# Altium project stm32-plc.PrjPcb (part 2 of 2)

## Sheet AOut_Isolator.SchDoc
size A4; SheetNumber: 3; SheetTotal: 16
Used 2 times, as channels U_AOUT1, U_AOUT2. Parts and nets are listed once, with the designators drawn on the sheet.
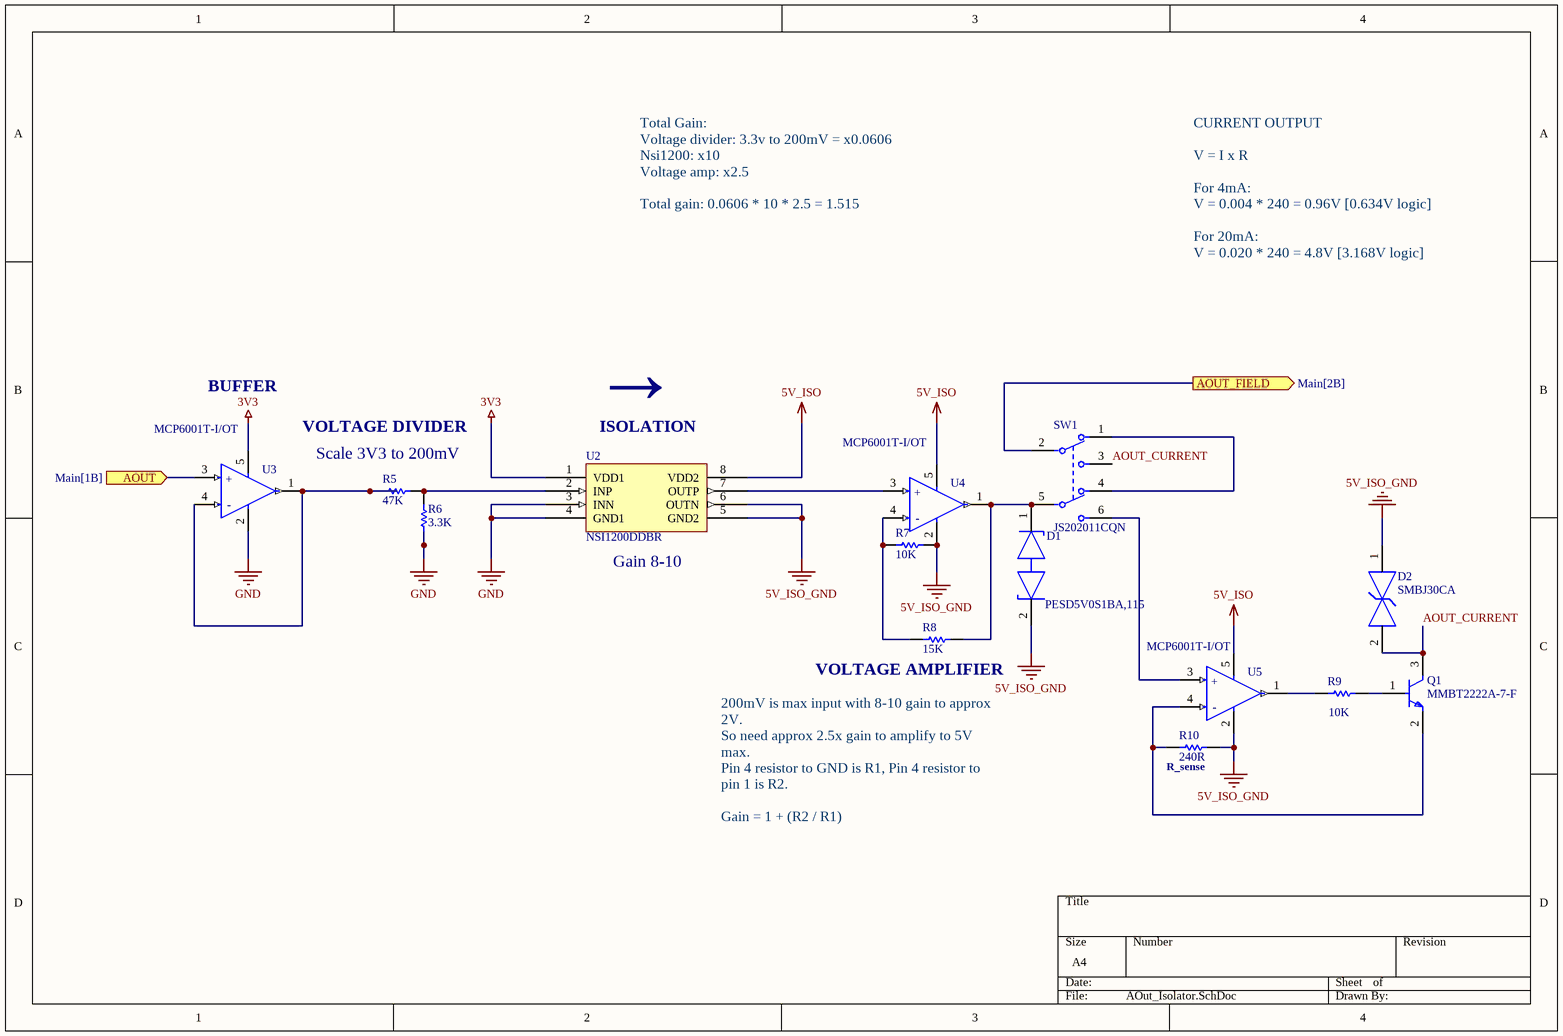
[diagram p9: AOut_Isolator.SchDoc]

### Parts
D1  PESD5V0S1BA,115  [FP-SOD323-CA-MFG]
D2  SMBJ30CA  [FP-SMBJ30CAHE3-52-MFG]
Q1  MMBT2222A-7-F  [FP-SOT23-IPC_A]
R5  47K  [RESC1608X55X30NL15T15]
R6  3.3K  [RESC1609X55X30ML15T15]
R7  10K  [RESC1609X55X30LL15T15]
R8  15K  [RESC1608X55X30NL15T15]
R9  10K  [RESC1609X55X30LL15T15]
R10  240R  [RESC3216X70X50NL05T20]
SW1  JS202011CQN  [FP-JS202011CQN-MFG]
U2  NSI1200DDBR  [NSI1200DDBR]
U3  MCP6001T-I/OT  [FP-C04-091-OT-IPC_A]
U4  MCP6001T-I/OT  [FP-C04-091-OT-IPC_A]
U5  MCP6001T-I/OT  [FP-C04-091-OT-IPC_A]

### Ports
AOUT (in, see Main[1B]), AOUT_FIELD (out, see Main[2B])

### Nets
3V3: U2.1(VDD1) U3.5(VDD)
5V_ISO: U2.8(VDD2) U4.5(VDD) U5.5(VDD)
5V_ISO_GND: D1.2(K2) D2.1 R7.2 R10.1 U2.5(GND2) U2.6(OUTN) U4.2(VSS) U5.2(VSS)
GND: R6.2 U2.3(INN) U2.4(GND1) U3.2(VSS)
AOUT: U3.3(VIN+) ; port AOUT
AOUT_CURRENT: D2.2 Q1.3(C) SW1.3
AOUT_FIELD: SW1.2 ; port AOUT_FIELD
NetD1_1: D1.1(K1) R8.2 SW1.5 U4.1(VOUT)
NetQ1_1: Q1.1(B) R9.2
NetQ1_2: Q1.2(E) R10.2 U5.4(VIN-)
NetR5_1: R5.1 U3.1(VOUT) U3.4(VIN-)
NetR5_2: R5.2 R6.1 U2.2(INP)
NetR7_1: R7.1 R8.1 U4.4(VIN-)
NetR9_1: R9.1 U5.1(VOUT)
NetSW1_1: SW1.1 SW1.4
NetSW1_6: SW1.6 U5.3(VIN+)
NetU2_7: U2.7(OUTP) U4.3(VIN+)

### Channels
U_AOUT1: designators end in A; ports AOUT=AOUT1 AOUT_FIELD=AOUT1_FIELD
U_AOUT2: designators end in B; ports AOUT=AOUT2 AOUT_FIELD=AOUT2_FIELD

### Notes on the sheet
- Total Gain:
  Voltage divider: 3.3v to 200mV = x0.0606
  Nsi1200: x10
  Voltage amp: x2.5
  Total gain: 0.0606 * 10 * 2.5 = 1.515
- CURRENT OUTPUT
  V = I x R
  For 4mA:
  V = 0.004 * 240 = 0.96V [0.634V logic]
  For 20mA:
  V = 0.020 * 240 = 4.8V [3.168V logic]
- (near U2) ←
- BUFFER
- VOLTAGE DIVIDER
- (near U2) ISOLATION
- Scale 3V3 to 200mV
- (near U2) Gain 8-10
- (near R8) VOLTAGE AMPLIFIER
- (near R10) R_sense
- 200mV is max input with 8-10 gain to approx 2V.
  So need approx 2.5x gain to amplify to 5V max.
  Pin 4 resistor to GND is R1, Pin 4 resistor to pin 1 is R2.
  Gain = 1 + (R2 / R1)
- (in symbol CMP-0187-00462-3) +; -

### Library data of the parts
D1 = CMP-14432-000001-1: TVS DIODE 5V 14V SOD323
D2 = CMP-02577-000018-1: TVS DIODE 30V 48.4V DO214AA; Manufacturer: Vishay Semiconductor Diodes Division; Manufacturer Part Number: SMBJ30CAHE3/52; Peak Pulse Power: 600W; Number Of Channels: 1; Automotive Grade: Grade 0; Peak Pulse Current: 12.4A; Standoff Height: 0mm; Max Junction Temp: +150°C; Breakdown Voltage: 33.3V; Direction: Bidirectional; Octopart: https://octopart.com/smbj30cahe3%2F52-vishay-43725255; Footprint Url: http://www.vishay.com/docs/95401/smb.pdf; Device Class L2: TVS Diodes; RoHS: TRUE; Automotive: Yes; Height: 2.44mm; Temperature: -55°C to +150°C; Category: Diode; ComponentLink2Description: Datasheet; Reverse Standoff Voltage: 30V; Device Class L3: unset; Package: DO-214AA; ComponentLink2URL: http://www.vishay.com/docs/88392/smbj.pdf; Temperature Range Low: -55°C; Mouser Description: Diode TVS Single Bi-Dir 30V 600W 2-Pin DO-214AA T/R; Temperature Range High: +150°C; Digikey Description: TVS DIODE 30V 48.4V DO214AA; Clamping Voltage: 48.4V; Lead Free: Yes; Device Class L1: Circuit Protection
Q1 = CMP-1693-00003-4: TRANS NPN 40V 0.6A SMD SOT23-3; Number of Elements: 1; Frequency: 300MHz; Max Collector Current: 600mA; Collector Base Voltage (VCBO): 75V; Current: 1A; Element Configuration: Single; Power Dissipation: 350mW; hFE Min: 100; Collector Emitter Saturation Voltage: 1V; Max Power Dissipation: 300mW; Emitter Base Voltage (VEBO): 6V; Voltage: 40V; Collector Emitter Breakdown Voltage: 40V; Width: 1.4mm; Polarity: NPN; Termination: SMD/SMT; Max Operating Temperature: 150°C; Transition Frequency: 300MHz; Contact Plating: Tin; Mount: Surface Mount; Max Frequency: 300MHz; Case/Package: SOT-23; Gain Bandwidth Product: 300MHz; Lead Free: Lead Free; Collector Emitter Voltage (VCEO): 40V; Radiation Hardening: No; Voltage Rating (DC): 40V; Height: 1mm; Max Breakdown Voltage: 40V; Packaging: Tape and Reel; Length: 3.05mm; Min Operating Temperature: -55°C; Weight: 0.000282oz; Current Rating: 600mA; REACH SVHC: No SVHC; Package Quantity: 3000; Continuous Collector Current: 600mA; Number of Pins: 3
R5 = CMP-2000-00523-2: Chip Resistor, 47 KOhm, +/- 1%, 0.1 W, -55 to 155 degC, 0603 (1608 Metric), RoHS, Tape and Reel; Case\Package: 0603; Forward Current: 20 mA; Power Rating: 90 mW; Illumination Colour: Red; Nominal Vf: 2.1 V; Viewing Angle: 160 degrees; Luminous Intensity: 63 mcd; Lens Style: Clear; Nominal Wavelength: 639 nm; Case Code (Imperial): 0603; Case Code (Metric): 1608; Packaging: Tape and Reel; Radiation Hardening: No; Colour: Red; PackageDescription: 2-Pin Surface Mount Device, Body 1.6 x 0.85 mm; ComponentLink1Description: Manufacturer URL; Width: 0.8 mm; DatasheetVersion: Apr-15; ComponentLink2URL: http://industrial.panasonic.com/cdbs/www-data/pdf/RDA0000/AOA0000C86.pdf; Min Operating Temperature: -40 degC; Height: 0.6 mm; Package Quantity: 3000; ComponentLink2Description: Datasheet; REACH SVHC: No SVHC; ComponentLink1URL: http://www.panasonic.com/; Mount: Surface Mount; RoHSCompliant: true; Max Operating Temperature: 100 degC; PackageReference: 0603; Length: 1.6 mm; Forward Voltage: 2.1 V; Pins: 2
R6 = CMP-2000-00436-2: Chip Resistors, 3.3 KOhm, +/- 1%, 0.1 W, 0603 (1608 Metric), -55 to 155 degC, RoHS, Tape and Reel; Manufacturer: Panasonic; Max Power Dissipation: 100mW; Voltage Rating: 75V; Temperature Coefficient: 100ppm/degreesC; Datasheet Version: 42095.0; Width: 0.8mm; Mount: SurfaceMount; Radiation Hardening: No; Package URL: http://www.st.com/st-web-ui/static/active/en/resource/technical/document/datasheet/CD00001320.pdf; Depth: 0.8mm; Package Description: 2-Pin Surface Mount Device, Body 1.6 x 0.85 mm; Package Quantity: 1; Contact Plating: Tin; Length: 1.6mm; Max Operating Temperature: 155degC; RoHSCompliant: true; Datasheet URL: https://industrial.panasonic.com/cdbs/www-data/pdf/RDA0000/AOA0000C283.pdf; Height: 0.022inch; Military Standard: Not; Termination: SMD/SMT; Case Code (Metric): 1608; Composition: ThickFilm; Resistance: 3.3KOhm; Packaging: TapeandReel; Min Operating Temperature: -55degC; Case/Package: 0603; Voltage Rating (DC): 75V; Lead Free: LeadFree; Package Reference: 0603; Power Rating: 100mW; Manufacturer URL: http://www.panasonic.com/; Case Code (Imperial): 0603; REACH SVHC: NoSVHC; Number of Terminations: 2; Number of Pins: 2; Tolerance: 1%
R7 R9 = CMP-1012-00623-3: Chip Resistor, 10 KOhm, +/- 1%, 0.1 W, -55 to 155 degC, 0603 (1608 Metric), RoHS, Tape and Reel; Manufacturer: Panasonic; Voltage Rating: 75V; Case\/Package: 0603; Power Rating: 100mW; Resistance: 10KOhm; Temperature Coefficient: 100ppm\/degreesC; Number of Pins: 2; Package Reference: 603; Depth: 0.8mm; Mount: SurfaceMount; Package Description: 2-Pin Surface Mount Device, Body 1.6 x 0.85 mm; Datasheet Version: 02/2017; Length: 1.6mm; Lead Free: LeadFree; Height: 0.45mm; Number of Terminations: 2; Max Power Dissipation: 100mW; Min Operating Temperature: -55degC; Datasheet URL: https://industrial.panasonic.com/cdbs/www-data/pdf/RDA0000/AOA0000C304.pdf; Termination: SMD/SMT; Case Code (Metric): 1608; Case Code (Imperial): 0603; Tolerance: 1%; Max Operating Temperature: 155degC; RoHSCompliant: true; Voltage Rating (DC): 75V; Radiation Hardening: No; Packaging: TapeandReel; Composition: ThickFilm; Mounting Technology: SurfaceMount; Manufacturer URL: http://www.panasonic.com/; Width: 0.031inch; REACH SVHC: NoSVHC; Contact Plating: Tin; Military Standard: Not; Package Quantity: 1
R8 = CMP-2000-00258-1: Part Number: ERJ-3EKF1502V; Manufacturer: Panasonic
R10 = CMP-2003-00592-1: Part Number: ERJ-8GEYJ241V; Manufacturer: Panasonic
SW1 = CMP-10038-000022-1: SWITCH SLIDE DPDT 300MA 6V; Contact Resistance: 70mR; Actuator Type: Standard; Actuator Color: Black; Actuator Material: Nylon; Actuator Length: 2mm; Contact Current Rating: 100mA; Electrical Life: 5000Cycles; Illumination Type: Non-Illuminated; Switch Function: On-On; Depth: 3.6mm; Lead Free: Lead Free; Current Rating: 300mA; Throw Configuration: DPDT; REACH SVHC: No SVHC; Flammability Rating: UL94 V-0; Contact Plating: Silver; Max Current Rating: 300mA; Packaging: Bulk; Radiation Hardening: No; Switch Travel: 2mm; Package Quantity: 1; Voltage Rating (DC): 6V; Housing Material: Nylon; Contact Material: Copper Alloy; Min Operating Temperature: -40°C; Max Operating Temperature: 85°C; Termination: PC Pins; Mount: Through Hole; Length: 9mm; Max Voltage Rating (DC): 6V; RoHS Compliant: Yes; Series: JS; Orientation: Vertical
U2 = NSI1200DDBR: High Reliability Reinforced Isolated Amplifier; Manufacturer: Novosense; Manufacturer Part Number: NSI1200DDBR; ComponentLink1Description: Datasheet; ComponentLink1URL: https://file.elecfans.com/web2/M00/63/D8/poYBAGMEo2GAVfdLABzacvfTaPY750.pdf
U3-U5 = CMP-0187-00462-3: IC OPAMP GP 1 CIRCUIT SOT23-5; Number of Amplifiers: 1; Voltage: 6V; Power Supply Rejection Ratio (PSRR): 86dB; Common Mode Rejection Ratio: 60dB; Unity Gain Bandwidth Product: 1MHz; Slew Rate: 0.6V/µs; Output Current per Channel: 23mA; Nominal Supply Current: 100uA; Input Offset Voltage (Vos): 4.5mV; Input Bias Current: 1pA; Operating Supply Voltage: 5.5V; Min Supply Voltage: 1.8V; Voltage Gain: 112dB; Length: 3.1mm; REACH SVHC: No SVHC; Number of Pins: 5; Package Quantity: 1; Radiation Hardening: No; Mount: Surface Mount; Number of Circuits: 1; Number of Elements: 1; Output Current: 23mA; Packaging: Tape and Reel; Height: 1.3mm; Lead Free: Lead Free; Min Operating Temperature: -40°C; Bandwidth: 1MHz; Contact Plating: Tin; Max Supply Voltage: 6V; Max Operating Temperature: 85°C; Width: 1.8mm; Case/Package: SOT-23; Operating Supply Current: 100uA; Number of Channels: 1; Gain Bandwidth Product: 1MHz

## Sheet BTN2_FactoryReset.SchDoc
size A4; SheetNumber: 13; SheetTotal: 16
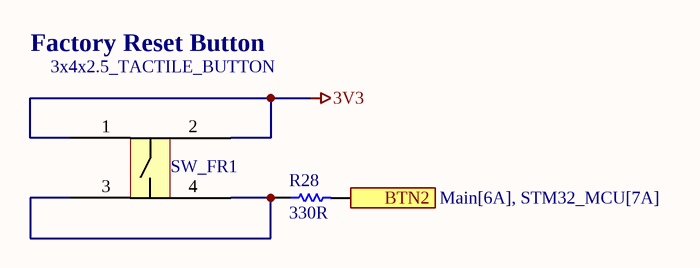
[diagram p10: BTN2_FactoryReset.SchDoc]

### Parts
R28  330R  [RESC1608X55X30LL15T15]
SW_FR1  3x4x2.5_TACTILE_BUTTON  [3x4x2.5_TACTILE_BUTTON]

### Ports
BTN2 (out, see Main[6A], STM32_MCU[7A])

### Nets
3V3: SW_FR1.1 SW_FR1.2
BTN2: R28.2 ; port BTN2
NetR28_1: R28.1 SW_FR1.3 SW_FR1.4

### Notes on the sheet
- Factory Reset Button

### Library data of the parts
R28 = CMP-2000-00435-2: Chip Resistor, 330 Ohm, +/- 1%, 0.1 W, -55 to 155 degC, 0603 (1608 Metric), RoHS, Tape and Reel; Gender: Male; Mating Cycles: 10000; Current Rating: 500 mA; Voltage Rating: 10 V; REACH SVHC: No SVHC; PackageDescription: 2-Pin Surface Mount Device, Body 1.6 x 0.85 mm; Contact Finish: Gold; Pins: 8; ComponentLink1Description: Manufacturer URL; Packaging: Tape and Reel; Max Operating Temperature: 85 degC; Contact Material: Copper; Height: 1.45 mm; Width: 1.45 mm; DatasheetVersion: Apr-15; Package Quantity: 1500; Contact Plating: Gold; PackageReference: 0603; Mount: Surface Mount; Lead Pitch: 1.1 mm; Min Operating Temperature: -25 degC; ComponentLink1URL: http://www.panasonic.com/; ComponentLink2URL: http://industrial.panasonic.com/cdbs/www-data/pdf/RDA0000/AOA0000C86.pdf; Length: 13.7 mm; ComponentLink2Description: Datasheet; RoHSCompliant: true

## Sheet STM32_MCU.SchDoc
size A3; SheetNumber: 7; SheetTotal: 16
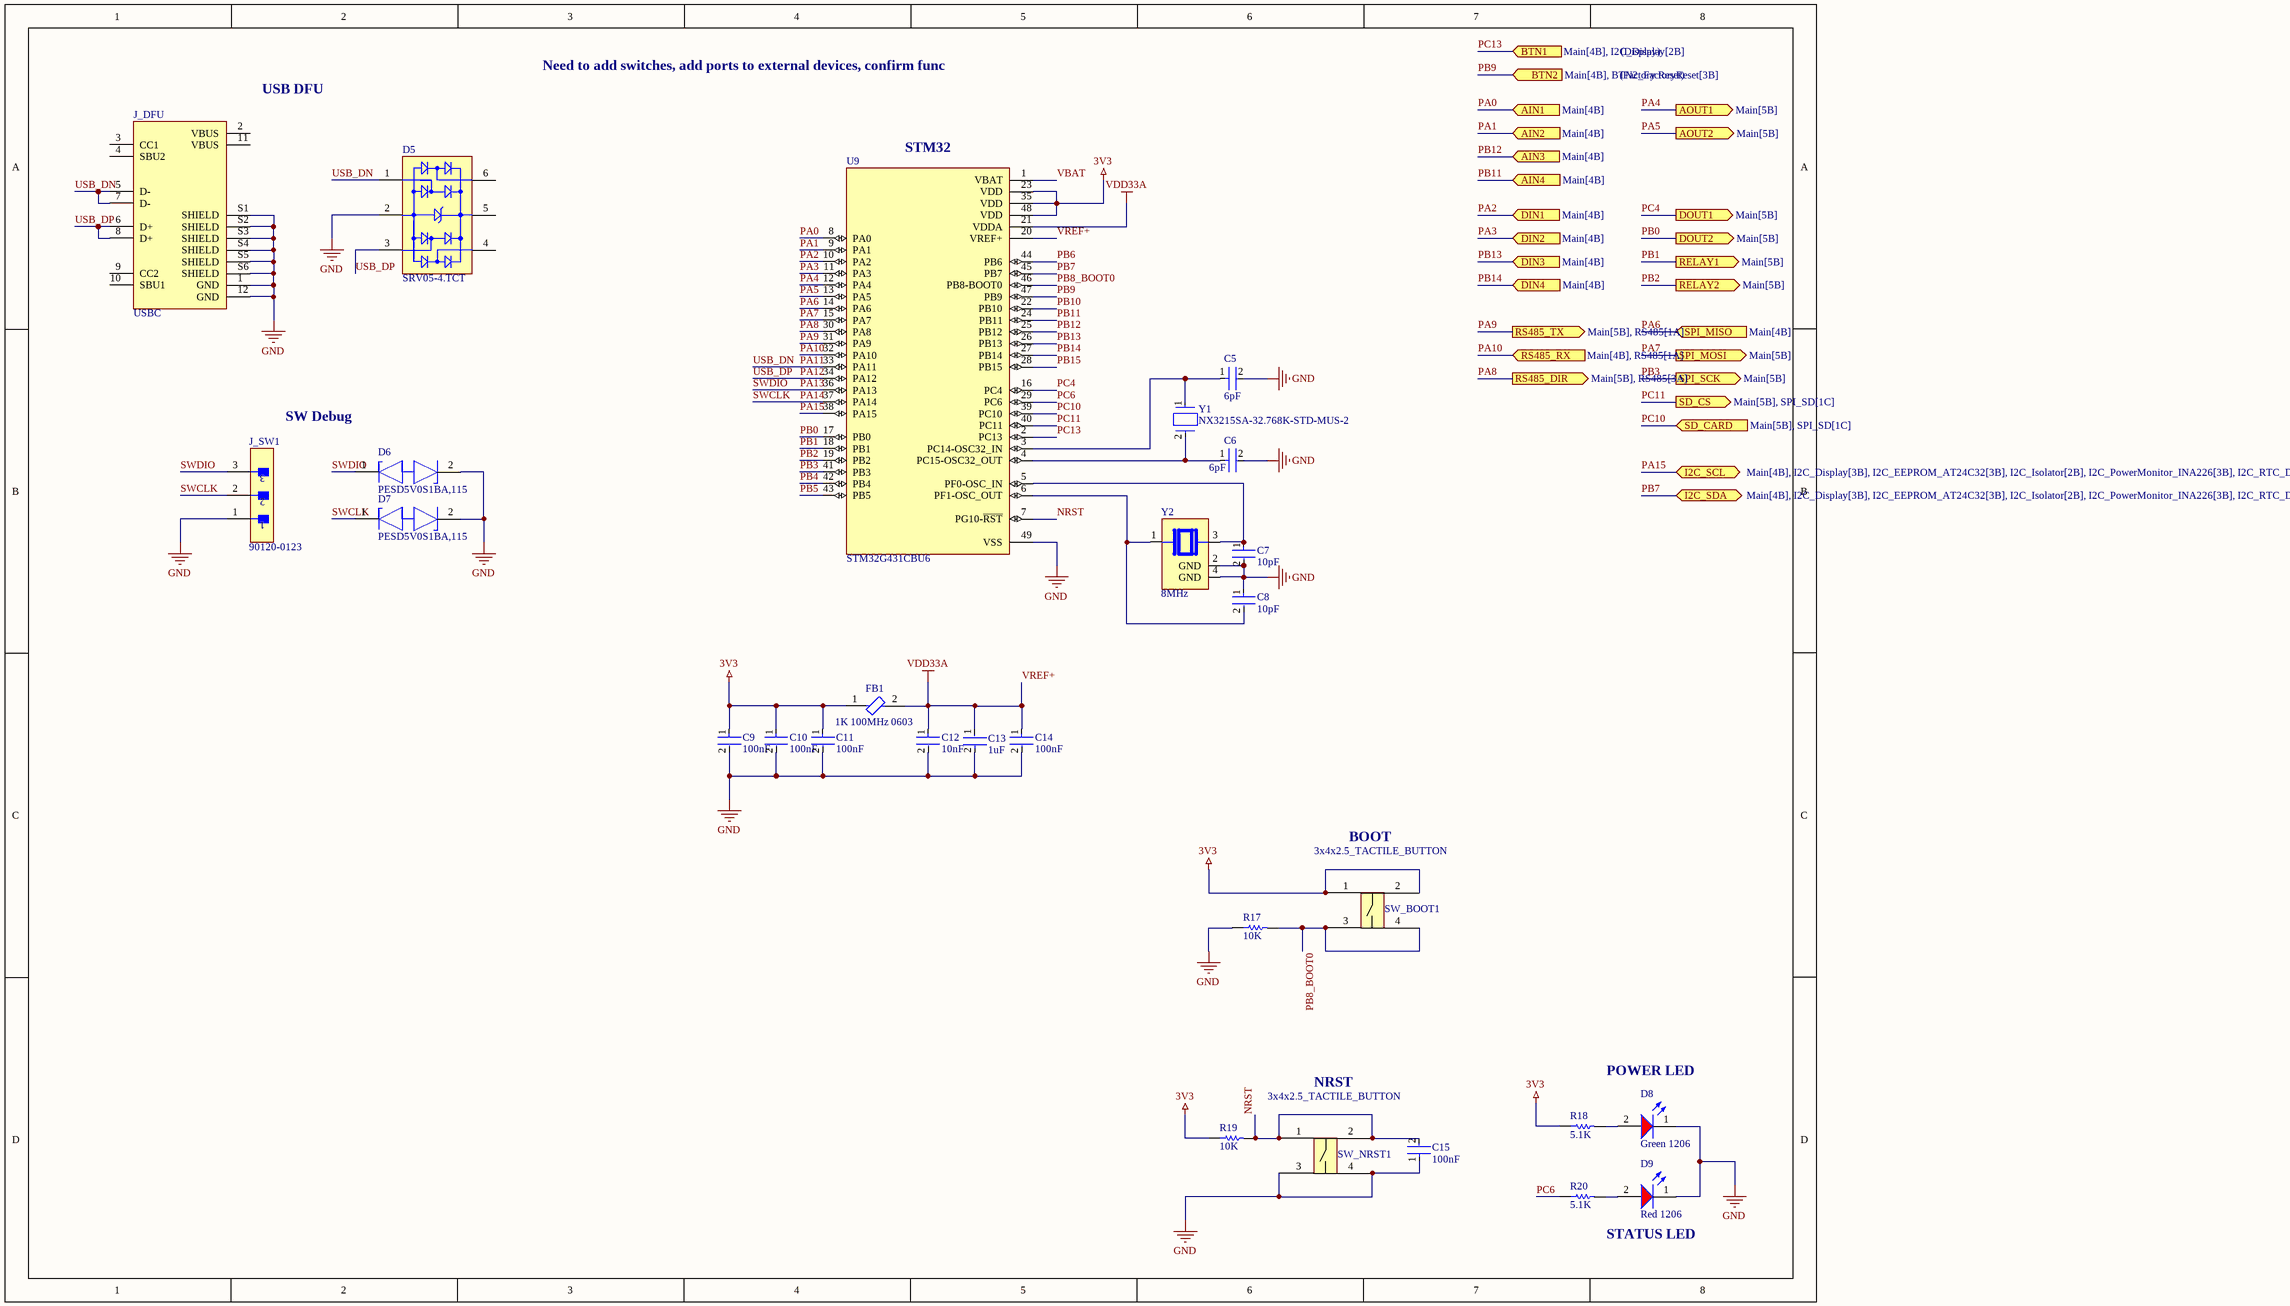
[diagram p11: STM32_MCU.SchDoc]

### Parts
C5  6pF  [FP-CGA3E-0_3-0_1-MFG]
C6  6pF  [FP-CGA3E-0_3-0_1-MFG]
C7  10pF  [FP-C0603C-CF-MFG]
C8  10pF  [FP-C0603C-CF-MFG]
C9  100nF  [FP-CGA3E-0_3-0_1-IPC_A]
C10  100nF  [FP-CGA3E-0_3-0_1-IPC_A]
C11  100nF  [FP-CGA3E-0_3-0_1-IPC_A]
C12  10nF  [FP-CC0603-DA-MFG]
C13  1uF  [FP-C1608-080-0_1-IPC_B]
C14  100nF  [FP-CGA3E-0_3-0_1-IPC_A]
C15  100nF  [FP-CGA3E-0_3-0_1-IPC_A]
D5  SRV05-4.TCT  [SMTC-SOT23-6_V]
D6  PESD5V0S1BA,115  [FP-SOD323-CA-MFG]
D7  PESD5V0S1BA,115  [FP-SOD323-CA-MFG]
D8  Green 1206  [WL-SMCW_1206_150120xx75000]
D9  Red 1206  [WL-SMCW_1206_150120xx75000]
FB1  1K 100MHz 0603  [FP-BLM18-0_15-t0_8-MFG]
J_DFU  USBC  [JAE_DX07S016JA1R1500]
J_SW1  90120-0123  [FP-90120-0123-MFG]
R17  10K  [RESC1609X55X30LL15T15]
R18  5.1K  [RESC1608X55X30LL15T15]
R19  10K  [RESC1609X55X30LL15T15]
R20  5.1K  [RESC1608X55X30LL15T15]
SW_BOOT1  3x4x2.5_TACTILE_BUTTON  [3x4x2.5_TACTILE_BUTTON]
SW_NRST1  3x4x2.5_TACTILE_BUTTON  [3x4x2.5_TACTILE_BUTTON]
U9  STM32G431CBU6  [QFN50P700X700X60-49N]
Y1  NX3215SA-32.768K-STD-MUS-2  [FP-NX3215SA-MFG]
Y2  8MHz  [XTAL_C3E-8.000-10-1020-M]

### Ports
AIN1 (in, see Main[4B]), AIN2 (in, see Main[4B]), AIN3 (in, see Main[4B]), AIN4 (in, see Main[4B]), AOUT1 (out, see Main[5B]), AOUT2 (out, see Main[5B]), BTN1 (in, see Main[4B], I2C_Display[2B]), BTN2 (in, see Main[4B], BTN2_FactoryReset[3B]), DIN1 (in, see Main[4B]), DIN2 (in, see Main[4B]), DIN3 (in, see Main[4B]), DIN4 (in, see Main[4B]), DOUT1 (out, see Main[5B]), DOUT2 (out, see Main[5B]), I2C_SCL (bidir, see Main[4B], I2C_Display[3B], I2C_EEPROM_AT24C32[3B], I2C_Isolator[2B], I2C_PowerMonitor_INA226[3B], I2C_RTC_DS3231[2B]), I2C_SDA (bidir, see Main[4B], I2C_Display[3B], I2C_EEPROM_AT24C32[3B], I2C_Isolator[2B], I2C_PowerMonitor_INA226[3B], I2C_RTC_DS3231[2B]), RELAY1 (out, see Main[5B]), RELAY2 (out, see Main[5B]), RS485_DIR (out, see Main[5B], RS485[3A]), RS485_RX (in, see Main[4B], RS485[1A]), RS485_TX (out, see Main[5B], RS485[1A]), SD_CARD (in, see Main[5B], SPI_SD[1C]), SD_CS (out, see Main[5B], SPI_SD[1C]), SPI_MISO (in, see Main[4B]), SPI_MOSI (out, see Main[5B]), SPI_SCK (out, see Main[5B])

### Nets
3V3: C9.1 C10.1 C11.1 FB1.1 R18.1 R19.1 SW_BOOT1.1 SW_BOOT1.2 U9.23(VDD) U9.35(VDD) U9.48(VDD)
GND: C5.2 C6.2 C7.2 C8.1 C9.2 C10.2 C11.2 C12.2 C13.2 C14.2 C15.1 D5.2(GND) D6.2(K2) D7.2(K2) D8.1(K) D9.1(K) J_DFU.1(GND) J_DFU.12(GND) J_DFU.S1(SHIELD) J_DFU.S2(SHIELD) J_DFU.S3(SHIELD) J_DFU.S4(SHIELD) J_DFU.S5(SHIELD) J_DFU.S6(SHIELD) J_SW1.1 R17.1 SW_NRST1.3 SW_NRST1.4 U9.49(VSS) Y2.2(GND) Y2.4(GND)
VREF+: C12.1 C13.1 C14.1 FB1.2 U9.20(VREF+) U9.21(VDDA)  [also labelled VDD33A]
NRST: C15.2 R19.2 SW_NRST1.1 SW_NRST1.2 U9.7(PG10-~{RST})
PA0: U9.8(PA0) ; port AIN1  [project net AIN1]
PA1: U9.9(PA1) ; port AIN2  [project net AIN2]
PA2: U9.10(PA2) ; port DIN1  [project net DIN1]
PA3: U9.11(PA3) ; port DIN2  [project net DIN2]
PA4: U9.12(PA4) ; port AOUT1  [project net AOUT1]
PA5: U9.13(PA5) ; port AOUT2  [project net AOUT2]
PA6: U9.14(PA6) ; port SPI_MISO  [project net DAT0]
PA7: U9.15(PA7) ; port SPI_MOSI  [project net CMD]
PA8: U9.30(PA8) ; port RS485_DIR
PA9: U9.31(PA9) ; port RS485_TX
PA10: U9.32(PA10) ; port RS485_RX
PA11: D5.1(I/O_1) J_DFU.5(D-) J_DFU.7(D-) U9.33(PA11)  [also labelled USB_DN]
PA12: D5.3(I/O_2) J_DFU.6(D+) J_DFU.8(D+) U9.34(PA12)  [also labelled USB_DP]
PA13: D6.1(K1) J_SW1.3 U9.36(PA13)  [also labelled SWDIO]
PA14: D7.1(K1) J_SW1.2 U9.37(PA14)  [also labelled SWCLK]
PA15: U9.38(PA15) ; port I2C_SCL  [project net I2C_SCL]
PB0: U9.17(PB0) ; port DOUT2  [project net DOUT2]
PB1: U9.18(PB1) ; port RELAY1
PB2: U9.19(PB2) ; port RELAY2
PB3: U9.41(PB3) ; port SPI_SCK
PB4: U9.42(PB4)
PB5: U9.43(PB5)
PB6: U9.44(PB6)
PB7: U9.45(PB7) ; port I2C_SDA  [project net I2C_SDA]
PB8_BOOT0: R17.2 SW_BOOT1.3 SW_BOOT1.4 U9.46(PB8-BOOT0)
PB9: U9.47(PB9) ; port BTN2  [project net BTN2]
PB10: U9.22(PB10)
PB11: U9.24(PB11) ; port AIN4  [project net AIN4]
PB12: U9.25(PB12) ; port AIN3  [project net AIN3]
PB13: U9.26(PB13) ; port DIN3  [project net DIN3]
PB14: U9.27(PB14) ; port DIN4  [project net DIN4]
PB15: U9.28(PB15)
PC4: U9.16(PC4) ; port DOUT1  [project net DOUT1]
PC6: R20.1 U9.29(PC6)
PC10: U9.39(PC10) ; port SD_CARD  [project net CARD_DETECT]
PC11: U9.40(PC11) ; port SD_CS  [project net DAT3]
PC13: U9.2(PC13) ; port BTN1  [project net BTN1]
VBAT: U9.1(VBAT)
NetC5_1: C5.1 U9.3(PC14-OSC32_IN) Y1.1
NetC6_1: C6.1 U9.4(PC15-OSC32_OUT) Y1.2
NetC7_1: C7.1 U9.5(PF0-OSC_IN) Y2.3
NetC8_2: C8.2 U9.6(PF1-OSC_OUT) Y2.1
NetD8_2: D8.2(A) R18.2
NetD9_2: D9.2(A) R20.2

Not connected (* = marked no-connect by the designer): D5 4(I/O_3) 5(VBUS) 6(I/O_4); J_DFU 2(VBUS) 3(CC1) 4(SBU2) 9(CC2) 10(SBU1) 11(VBUS)

### Notes on the sheet
- USB DFU
- Need to add switches, add ports to external devices, confirm func
- (Display)
- (Factory Reset)
- (near U9) STM32
- SW Debug
- BOOT
- NRST
- POWER LED
- STATUS LED

### Library data of the parts
C5 C6 = CMP-08246-001317-1: Cap Ceramic 6pF 50V C0G 0.5pF Pad SMD 0603 +125°C Automotive T/R; Weight: 7.1E-05oz; Capacitance: 6pF; Min Operating Temperature: -55°C; Termination: SMD/SMT; Mount: Surface Mount; Thickness: 0.035inch; Voltage Rating: 50V; Case Code (Metric): 1608; Package Quantity: 1; Length: 1.6mm; Dielectric: C0G; REACH SVHC: No SVHC; Packaging: Tape and Reel; Height: 0.8mm; Composition: Ceramic; Depth: 0.8mm; Case Code (Imperial): 0603; Case/Package: 0603; Max Operating Temperature: 125°C; Voltage Rating (DC): 50V; Ratings: AEC-Q200; Width: 0.031inch
C7 C8 = CMP-2006-03343-2: CAP CER 10PF 50V NP0 0603; Manufacturer: KEMET; Manufacturer Part Number: C0603C100C5GACTU; Material: Ceramic; Temperature Coefficient: 30ppm/°C; Automotive Grade: Grade 1; Tolerance: 0.25 pF; Temperature Characteristic: C0G; Device Class L3: Ceramic Capacitors; Value: 10 pF; Device Class L1: Passive Components; Lead Free: Yes; RoHS: TRUE; Voltage Rating: 50 V; Automotive: Yes; Capacitance: 10 pF; Height: 0.87mm; Temperature Range Low: -55°C; Temperature Range High: +125°C; Mouser Description: Multilayer Ceramic Capacitors MLCC - SMD/SMT 50volts 10pF C0G 0.25%; Device Class L2: Capacitors; Digikey Description: CAP CER 10PF 50V NP0 0603; ComponentLink2Description: Datasheet; Package: C0603C-CF; ComponentLink2URL: https://api.kemet.com/component-edge/download/datasheet/C0603C100J5GACAUTO.pdf; Category: Cap; Octopart: https://octopart.com/c0603c100c5gactu-kemet-9138556; Temperature: -55°C to +125°C
C9-C11 C14 C15 = CMP-2000-07546-2: Cap Ceramic 100nF 50V X7R 10% Pad SMD 0603 +125°C Automotive T/R; Weight: 7.1E-05oz; Composition: Ceramic; Max Operating Temperature: 125°C; Termination: SMD/SMT; Dielectric: X7R; Length: 1.6mm; Package Quantity: 1; REACH SVHC: No SVHC; Lead Free: Lead Free; Case Code (Metric): 1608; Min Operating Temperature: -55°C; Packaging: Tape and Reel; Tolerance: 10%; Voltage Rating: 50V; Case Code (Imperial): 0603; Capacitance: 100nF; Case/Package: 0603; Voltage Rating (DC): 50V; Depth: 0.8mm; Radiation Hardening: No; Ratings: AEC-Q200; Mount: Surface Mount; Voltage: 50V; Thickness: 0.035inch; Width: 0.8mm; Height: 0.8mm
C12 = CMP-2100-03600-2: CAP CER 10000PF 50V X7R 0603; Manufacturer Part Number: CC0603KRX7R9BB103; Manufacturer: YAGEO; Tolerance: 0.1; Material: Ceramic; Temperature Coefficient: 15%; Mouser Description: Multilayer Ceramic Capacitor, CC Series, 0.01 - F, - 10%, X7R, 50 V, 0603 [1608 Metric]; Digikey Description: CAP CER 10000PF 50V X7R 0603; Height: 0.9mm; Category: Cap; Temperature Characteristic: X7R; Footprint Url: http://www.yageo.com/exep/pages/download/literatures/UPY-C_GEN_24.pdf; Lead Free: Yes; Voltage Rating: 50 V; Temperature: -55°C to +125°C; Device Class L3: Ceramic Capacitors; ComponentLink2Description: Datasheet; Voltage: 50 V; Package: CC0603-DA; Octopart: https://octopart.com/cc0603krx7r9bb103-yageo-192938; Automotive: No; Temperature Range High: +125°C; Temperature Range Low: -55°C; Value: 10 nF; RoHS: TRUE; Device Class L1: Passive Components; ComponentLink2URL: http://www.yageo.com/documents/recent/UPY-GPHC_X7R_6.3V-to-50V_18.pdf; Device Class L2: Capacitors; Capacitance: 10 nF
C13 = CMP-2000-06025-2: Multilayer Ceramic Capacitors 1μF ±10% 50V X5R SMD 0603; Lead Free: Lead Free; Height: 0.8mm; Mount: Surface Mount; Radiation Hardening: No; Thickness: 0.035inch; Length: 1.6mm; Max Operating Temperature: 85°C; REACH SVHC: No SVHC; Min Operating Temperature: -55°C; Construction: Flat; RoHS Compliant: Yes; Voltage Rating: 50V; Dielectric: X5R; Packaging: Tape and Reel; Termination: SMD/SMT; Voltage Rating (DC): 50V; Case Code (Imperial): 0603; Voltage: 50V; Width: 0.031inch; Weight: 7.1E-05oz; Capacitance: 1uF; Depth: 0.8mm; Case Code (Metric): 1608; Series: C; Case/Package: 0603; Tolerance: 10%; Resistor Type: Ceramic; Number of Pins: 2; Dielectric Material: Ceramic; Package Quantity: 1
D5 = CMP-2000-05358-1: RailClamp(R) Low Capacitance TVS Diode Array, 5 pF, 17.5 VC, -55 to 125 degC, 6-Pin SOT23, RoHS, Tape and Reel; Manufacturer: Semtech; Leakage Current (Max): 5uA; Polarity: Uni-Directional; Peak Pulse Power Dissipation: 300W; Clamping Voltage: 17.5V; Number of Elements: 1; Working Voltage: 5V; Test Current (It): 1mA; Configuration: Quad; Reverse Breakdown Voltage: 6V; Suppressor Type: DiodeArrays; Peak Pulse Current: 12A; Product Depth (mm): 1.6mm; Product Height (mm): 1.15mm; Clamping Voltage (Max): 12.5V; Rad Hardened: No; Product Length (mm): 2.9mm; Capacitance Value: 5pF; Mounting: SurfaceMount; Datasheet URL: https://datasheet.ciiva.com/8029/srv05-4-8029973.pdf; Datasheet Version: Jan-08; Packaging: TapeandReel; Package / Case: SOT-23; Operating Temp Range: -55Cto125C; Pin Count: 6; Direction Type: Uni-Directional; Operating Temperature Min Deg. C: -55C; Reverse Stand-off Voltage: 5V; Leakage Current: 5uA; Manufacturer URL: http://www.semtech.com/; Working Voltage (Max): 5V; Package Reference: SOT23-6; Package Description: 6-Pin Small Outline Transistor, Body 2.9 x 1.6 mm, Pitch 0.95 mm; Operating Temperature Max Deg. C: 125C; Operating Temperature Classification: Military; Mounting Style: SurfaceMount
D6 D7 = CMP-14432-000001-1: TVS DIODE 5V 14V SOD323
D8 D9 = CMP-1426-00017-3: Led, Red, 630 Nm, 1.9 V, 30 Ma, 60 Mcd Rohs Compliant: Yes; Forward Current: 100mA; Max Reverse Voltage (DC): 5V; Lens Style: Clear, Rectangular; Viewing Angle: 140°; Luminous Intensity: 60mcd; Peak Wavelength: 645nm; Forward Voltage: 1.9V; Test Current: 20mA; Dominant Wavelength: 630nm; Case Code (Imperial): 1206; Length: 3.2mm; Mount: Surface Mount; Case Code (Metric): 3216; Case/Package: 1206; Min Operating Temperature: -40°C; Width: 1.6mm; Color: Red; Height: 680µm; REACH SVHC: Unknown; Max Operating Temperature: 85°C; Wavelength: 630nm; RoHS: Compliant; Packaging: Tape and Reel
FB1 = CMP-0686-00457-3: Chip Ferrite Bead, 0603, 1000Ω @ 100MHz, 0.5Ω, 25%, 450mA; Number of Circuits: 1; Max DC Current: 400mA; Shielding: Unshielded; DC Resistance (DCR): 500mR; Material: Steel; DC Resistance-Max: 700mR; Impedance: 1kR; Case Code (Imperial): 0603; Max Current Rating: 400mA; Frequency: 100MHz; Min Operating Temperature: -55°C; Case/Package: 0603; Depth: 0.8mm; Lead Free: Lead Free; Core Material: Ferrite; Current Rating: 400mA; Resistance: 500mR; Case Code (Metric): 1608; DC Current: 400mA; Package Quantity: 1; Packaging: Tape and Reel; Width: 0.8mm; Military Standard: Not; Height: 0.8mm; Series: BLM18A; Max Operating Temperature: 125°C; Tolerance: 25%; Termination: SMD/SMT; Test Frequency: 100MHz; Number of Lines: 1; Number of Pins: 2; REACH SVHC: No SVHC; Length: 1.6mm; Radiation Hardening: No
J_DFU = DX07S016JA1R1500: USB-C (USB TYPE-C) USB 2.0 Receptacle Connector 24 (16+8 Dummy) Position Surface Mount, Right Angle; Through Hole; Package: None; Value: *; Price: None; MP: DX07S016JA1R1500; Availability: Unavailable
J_SW1 = CMP-04776-000237-1: CONN HEADER VERT 3POS 2.54MM; Number of Circuits: 3; Max Voltage Rating (DC): 350.35kV; Contact Resistance: 20mR; Gender: Male; Voltage Rating (AC): 350V; Glow Wire Compliant: Non-compliant; Current Rating: 3A; Contact Post Length: 2.9mm; Number of Contacts: 3; Number of Rows: 1; Max Operating Temperature: 125°C; Orientation: Vertical; Number of Positions: 3; Packaging: Tray; Contact Mating Length: 6.75mm; Housing Color: Black; Termination: Solder; Contact Material: Brass; Radiation Hardening: No; Lead Free: Lead Free; Pitch: 2.54mm; RoHS Compliant: Yes; Voltage Rating: 350V; Contact Plating: Tin; Color: Black; Min Operating Temperature: -55°C; Mount: Through Hole; Housing Material: Polyester; Series: 90120; Contact Gender: Male; REACH SVHC: No SVHC
R17 R19 = CMP-1012-00623-3: as R7 on sheet AOut_Isolator; Number of Pins: 2; Package Reference: 603; Depth: 0.8mm; Mount: SurfaceMount; Package Description: 2-Pin Surface Mount Device, Body 1.6 x 0.85 mm; Datasheet Version: 02/2017; Length: 1.6mm; Lead Free: LeadFree; Height: 0.45mm; Number of Terminations: 2; Max Power Dissipation: 100mW; Min Operating Temperature: -55degC; Datasheet URL: https://industrial.panasonic.com/cdbs/www-data/pdf/RDA0000/AOA0000C304.pdf; Termination: SMD/SMT; Case Code (Metric): 1608; Case Code (Imperial): 0603; Tolerance: 1%; Max Operating Temperature: 155degC; RoHSCompliant: true; Voltage Rating (DC): 75V; Radiation Hardening: No; Packaging: TapeandReel; Composition: ThickFilm; Mounting Technology: SurfaceMount; Manufacturer URL: http://www.panasonic.com/; Width: 0.031inch; REACH SVHC: NoSVHC; Contact Plating: Tin; Military Standard: Not; Package Quantity: 1
R18 R20 = CMP-2000-00803-1: Part Number: ERJ-3GEYJ512V; Manufacturer: Panasonic
U9 = STM32G431CBU6: ARMÂ® CortexÂ®-M4F STM32G4 Microcontroller IC 32-Bit Single-Core 170MHz 128KB (128K x 8) FLASH 48-UFQFPN (7x7); MF: STMicroelectronics; SnapEDA_Link: https://www.snapeda.com/parts/STM32G431CBU6/STMicroelectronics/view-part/?ref=snap; Package: UFQFPN-48 STMicroelectronics; Value: *; MP: STM32G431CBU6; Check_prices: https://www.snapeda.com/parts/STM32G431CBU6/STMicroelectronics/view-part/?ref=eda
Y1 = CMP-200220-000010-1: CRYSTAL 32.7680KHZ 12.5PF SMD; Frequency Tolerance: 20ppm; ESR (Equivalent Series Resistance): 70kR; Frequency: 32.768kHz; Length: 0.126inch; Number of Pins: 2; Max Operating Temperature: 125°C; Width: 0.059inch; Load Capacitance: 12.5pF; Case/Package: SMD/SMT; Height: 0.035inch; Packaging: Tape and Reel; Mount: Surface Mount; Package Quantity: 1000; Min Operating Temperature: -40°C
Y2 = C3E-8.000-10-1020-M: Package: None; Price: None; Value: *; MP: C3E-8.000-10-1020-M; Availability: Unavailable

## Sheet I2C_PowerMonitor_INA226.SchDoc
size A4; SheetNumber: 10; SheetTotal: 16
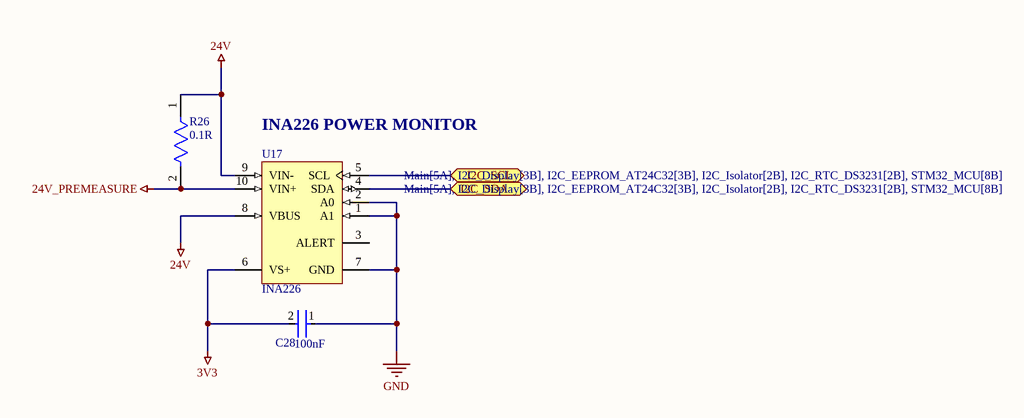
[diagram p12: I2C_PowerMonitor_INA226.SchDoc]

### Parts
C28  100nF  [FP-CGA3E-0_3-0_1-IPC_A]
R26  0.1R  [FP-RMCF2512-IPC_B]
U17  INA226  [DGS0010A_L]

### Ports
I2C_SCL (bidir, see Main[5A], I2C_Display[3B], I2C_EEPROM_AT24C32[3B], I2C_Isolator[2B], I2C_RTC_DS3231[2B], STM32_MCU[8B]), I2C_SDA (bidir, see Main[5A], I2C_Display[3B], I2C_EEPROM_AT24C32[3B], I2C_Isolator[2B], I2C_RTC_DS3231[2B], STM32_MCU[8B])

### Nets
3V3: C28.2 U17.6(VS+)
24V: R26.1 U17.8(VBUS) U17.9(VIN-)
24V_PREMEASURE: R26.2 U17.10(VIN+)
GND: C28.1 U17.1(A1) U17.2(A0) U17.7(GND)
I2C_SCL: U17.5(SCL) ; port I2C_SCL
I2C_SDA: U17.4(SDA) ; port I2C_SDA

Not connected (* = marked no-connect by the designer): U17 3(ALERT)

### Notes on the sheet
- (near U17) INA226 POWER MONITOR

### Library data of the parts
C28 = CMP-2000-07546-2: as C9 on sheet STM32_MCU; Weight: 7.1E-05oz; Composition: Ceramic; Max Operating Temperature: 125°C; Termination: SMD/SMT; Dielectric: X7R; Length: 1.6mm; Package Quantity: 1; REACH SVHC: No SVHC; Lead Free: Lead Free; Case Code (Metric): 1608; Min Operating Temperature: -55°C; Packaging: Tape and Reel; Tolerance: 10%; Voltage Rating: 50V; Case Code (Imperial): 0603; Capacitance: 100nF; Case/Package: 0603; Voltage Rating (DC): 50V; Depth: 0.8mm; Radiation Hardening: No; Ratings: AEC-Q200; Mount: Surface Mount; Voltage: 50V; Thickness: 0.035inch; Width: 0.8mm; Height: 0.8mm
R26 = CMP-26527-001289-1: 0.1Ω ±5% 1W 2512 Thick Film Chip Resistor AEC-Q200 compliant; Temperature Coefficient: 200ppm/°C; Resistance: 100mR; Tolerance: 5%; Contact Plating: Tin; Series: RMCF; Case Code (Metric): 6432; Max Power Dissipation: 1W; RoHS Compliant: Yes; Construction: Rectangular; Case/Package: 2512; Power Rating: 1W; Resistor Type: Thick Film; Length: 0.248inch; Features: Automotive AEC-Q200; Mount: Surface Mount; Size Code: 2512; Height: 0.028inch; Max Operating Temperature: 155°C; Number of Terminations: 2; Packaging: Tape and Reel; Min Operating Temperature: -55°C; Military Standard: Not; Depth: 3.2mm; Case Code (Imperial): 2512; Lead Free: Lead Free; Radiation Hardening: No; Width: 0.126inch
U17 = CMP-0704-00058-2: High-Side Measurement, Bi-Directional Current / Power Monitor with I2C Interface, 2.7 to 5.5 V, -40 to 125 degC, 10-pin SOP (DGS10), Green (RoHS & no Sb/Br); PartNumber: INA226AIDGSR; Vs(Max)(V): 5.5; CMRR(Min)(dB): 126; Rating: Catalog; Input Offset (+/-)(Max)(uV): 10; Small-Signal Bandwidth(Typ)(MHz): 0.007; Input Offset Drift (+/-)(Max)(uV/Degrees Celsius): 0.1; Common Mode Range(Max)(V): 36; Gain(V/V): 1; SubFamily: Current Shunt Monitor; Quiescent Current (+/-)(Typ)(mA): 0.33; Vs(Min)(V): 2.7; Common Mode Range(Min)(V): 0; ComponentLink2URL: http://www.ti.com/general/docs/lit/getliterature.tsp?genericPartNumber=INA226&fileType=pdf; ComponentLink1URL: http://www.ti.com/; Mounting Technology: Surface Mount; PackageDescription: 10-Pin Plastic Small Outline, Body 3 x 3 mm, Pitch 0.5 mm; ComponentLink3Description: Package Specification; Code_JEDEC: MO-153; Eco-Plan: Green (RoHS & no Sb/Br); PackageReference: DGS0010A; ComponentLink2Description: Datasheet; ComponentLink3URL: http://www.ti.com/lit/ml/mpds035b/mpds035b.pdf; ComponentLink1Description: Manufacturer URL; DatasheetVersion: SBOS547; PackageVersion: 4073272/C, 02/2004

## Sheet DOut_Relay.SchDoc
size A4; SheetNumber: 15; SheetTotal: 16
Used 2 times, as channels U_RELAY1, U_RELAY2. Parts and nets are listed once, with the designators drawn on the sheet.
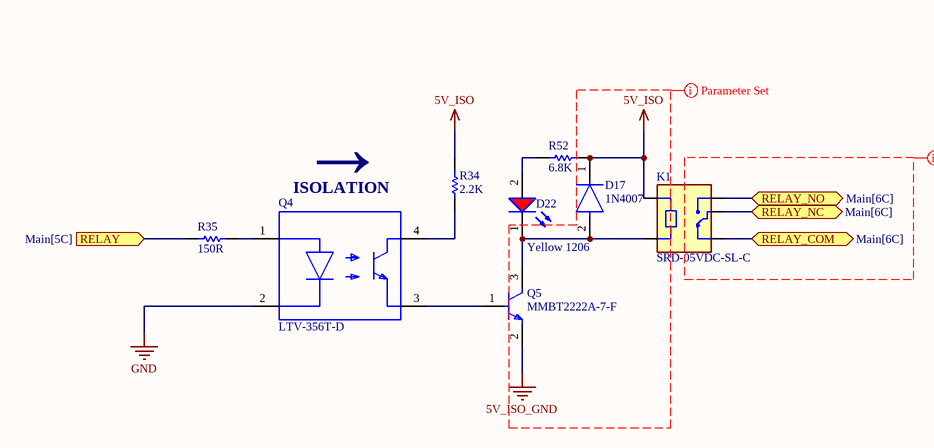
[diagram p13: DOut_Relay.SchDoc]

### Parts
D17  1N4007  [FP-1N4007_SMD-IPC_C]
D22  Yellow 1206  [WL-SMCW_1206_150120xx75000]
K1  SRD-05VDC-SL-C  [RELAY_SRD-05VDC-SL-C]
Q4  LTV-356T-D  [FP-LTV-356T-D-MFG]
Q5  MMBT2222A-7-F  [FP-SOT23-IPC_A]
R34  2.2K  [RESC1608X55X30LL15T15]
R35  150R  [RESC1608X55X30ML20T20]
R52  6.8K  [RESC1608X55X30LL15T15]

### Ports
RELAY (in, see Main[5C]), RELAY_COM (bidir, see Main[6C]), RELAY_NC (bidir, see Main[6C]), RELAY_NO (bidir, see Main[6C])

### Nets
5V_ISO: D17.1(C) K1.A1 R34.1 R52.2
5V_ISO_GND: Q5.2(E)
GND: Q4.2(C)
RELAY: R35.1 ; port RELAY
RELAY_COM: K1.NC ; port RELAY_COM
RELAY_NC: K1.COM ; port RELAY_NC
RELAY_NO: K1.NO ; port RELAY_NO
NetD17_2: D17.2(A) D22.1(K) K1.A2 Q5.3(C)
NetD22_2: D22.2(A) R52.1
NetQ4_1: Q4.1(A) R35.2
NetQ4_3: Q4.3(E) Q5.1(B)
NetQ4_4: Q4.4(C) R34.2

### Channels
U_RELAY1: designators end in A; ports RELAY=PB1 RELAY_COM=NetJ_RELAY1_2 RELAY_NC=NetJ_RELAY1_1 RELAY_NO=NetJ_RELAY1_3
U_RELAY2: designators end in B; ports RELAY=PB2 RELAY_COM=NetJ_RELAY2_2 RELAY_NC=NetJ_RELAY2_1 RELAY_NO=NetJ_RELAY2_3

### Layout directives
net class RELAY_COIL: 5V_ISO, 5V_ISO_GND
net class RELAY: (no net found under the mark)

### Notes on the sheet
- (near Q4) ←
- (near Q4) ISOLATION

### Library data of the parts
D17 = CMP-12389-000001-1: Rectifier, 1Kv, 1A, Do-214Ac Rohs Compliant: Yes
D22 = CMP-1426-00017-3: as D8 on sheet STM32_MCU; Case Code (Imperial): 1206; Length: 3.2mm; Mount: Surface Mount; Case Code (Metric): 3216; Case/Package: 1206; Min Operating Temperature: -40°C; Width: 1.6mm; Color: Red; Height: 680µm; REACH SVHC: Unknown; Max Operating Temperature: 85°C; Wavelength: 630nm; RoHS: Compliant; Packaging: Tape and Reel
K1 = SRD-05VDC-SL-C: 5V Trigger Relay Module For Arduino And Raspberry Pi 5V Trigger Relay Module For Arduino And Raspberry Pi; MF: Songle Relay; Check_prices: https://www.snapeda.com/parts/SRD-05VDC-SL-C/Songle+Relay/view-part/?ref=eda; Value: *; Availability: Not in stock; Price: None; Package: NON STANDARD-5 Songle Relay; MP: SRD-05VDC-SL-C; SnapEDA_Link: https://www.snapeda.com/parts/SRD-05VDC-SL-C/Songle+Relay/view-part/?ref=snap
Q4 = CMP-22018-000003-1: OPTOCPL 1 CH TRAN OUT SMT; Manufacturer: Lite-On; Collector Emitter Voltage: 80V; Standoff Height: 0mm; Power Dissipation: 170mW; Forward Current: 20mA; Emiiter Collector Voltage: 6V; Isolation Voltage: 3750Vrms; Max Junction Temp: +125°C; Forward Voltage: 1.2V; Max Current Transfer Ratio: 600%; Min Current Transfer Ratio: 300%; RoHS: TRUE; Device Class L3: unset; Package: LTV-356T-D; Temperature Range High: +110°C; Temperature Range Low: -55°C; Device Class L2: Optocouplers; Reverse Voltage: 6V; Temperature: -55°C to +110°C; Manufacturer Part Number: LTV-356T-D; Category: Trans; ComponentLink2URL: https://ve.mouser.com/datasheet/2/239/LTV-356T%20series%20201610-1139805.pdf; Octopart: https://octopart.com/ltv-356t-d-lite-on-11764243; Automotive: No; Digikey Description: OPTOCPL 1 CH TRAN OUT SMT; ComponentLink2Description: Datasheet; Height: 2.4mm; Device Class L1: Optoelectronics; Lead Free: Yes
Q5 = CMP-1693-00003-4: as Q1 on sheet AOut_Isolator; Voltage: 40V; Collector Emitter Breakdown Voltage: 40V; Width: 1.4mm; Polarity: NPN; Termination: SMD/SMT; Max Operating Temperature: 150°C; Transition Frequency: 300MHz; Contact Plating: Tin; Mount: Surface Mount; Max Frequency: 300MHz; Case/Package: SOT-23; Gain Bandwidth Product: 300MHz; Lead Free: Lead Free; Collector Emitter Voltage (VCEO): 40V; Radiation Hardening: No; Voltage Rating (DC): 40V; Height: 1mm; Max Breakdown Voltage: 40V; Packaging: Tape and Reel; Length: 3.05mm; Min Operating Temperature: -55°C; Weight: 0.000282oz; Current Rating: 600mA; REACH SVHC: No SVHC; Package Quantity: 3000; Continuous Collector Current: 600mA; Number of Pins: 3
R34 = CMP-2000-00336-1: Part Number: ERJ3EKF2201V; Manufacturer: Panasonic
R35 = CMP-2000-00914-1: Part Number: ERA3AEB151V; Manufacturer: Panasonic
R52 = CMP-2000-00803-1: as R18 on sheet STM32_MCU

## Sheet DIn_Isolator.SchDoc
size A4; SheetNumber: 16; SheetTotal: 16
Used 4 times, as channels U_DIN1, U_DIN2, U_DIN3, U_DIN4. Parts and nets are listed once, with the designators drawn on the sheet.
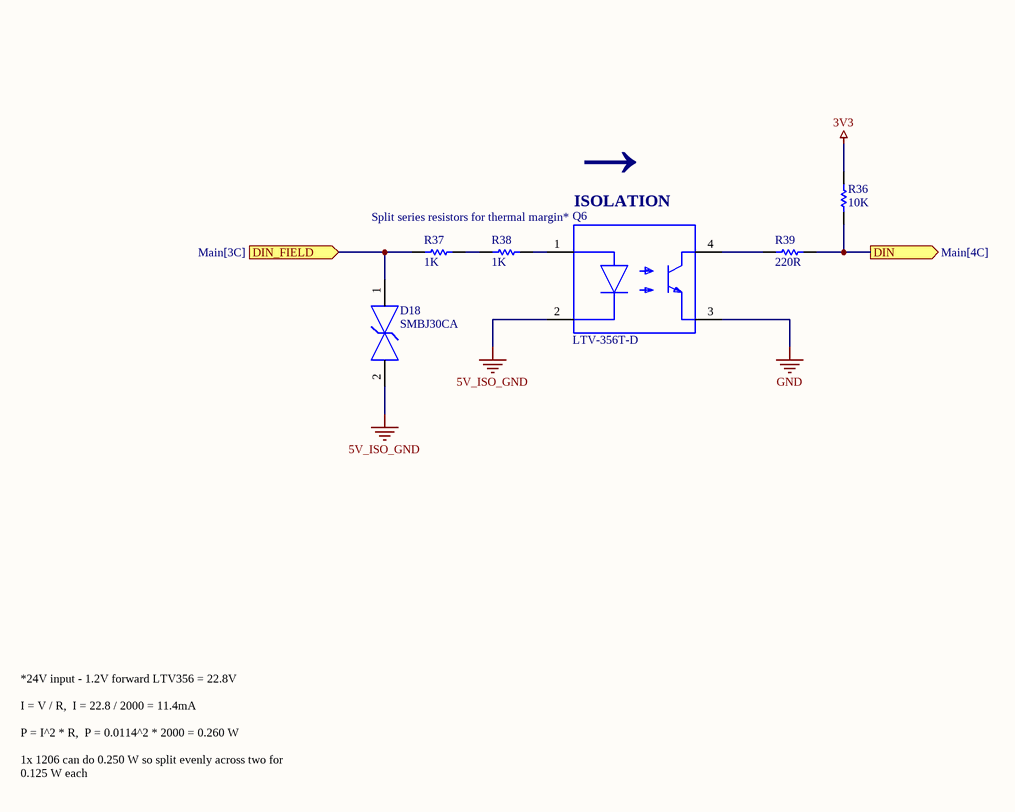
[diagram p14: DIn_Isolator.SchDoc]

### Parts
D18  SMBJ30CA  [FP-SMBJ30CAHE3-52-MFG]
Q6  LTV-356T-D  [FP-LTV-356T-D-MFG]
R36  10K  [RESC1609X55X30LL15T15]
R37  1K  [RESC3216X70X50ML20T25]
R38  1K  [RESC3216X70X50ML20T25]
R39  220R  [RESC1608X55X30LL15T15]

### Ports
DIN (out, see Main[4C]), DIN_FIELD (in, see Main[3C])

### Nets
3V3: R36.1
5V_ISO_GND: D18.2 Q6.2(C)
GND: Q6.3(E)
DIN: R36.2 R39.2 ; port DIN
DIN_FIELD: D18.1 R37.1 ; port DIN_FIELD
NetQ6_1: Q6.1(A) R38.2
NetQ6_4: Q6.4(C) R39.1
NetR37_2: R37.2 R38.1

### Channels
U_DIN1: designators end in A; ports DIN=DIN1 DIN_FIELD=DIN1_FIELD
U_DIN2: designators end in B; ports DIN=DIN2 DIN_FIELD=DIN2_FIELD
U_DIN3: designators end in C; ports DIN=DIN3 DIN_FIELD=DIN3_FIELD
U_DIN4: designators end in D; ports DIN=DIN4 DIN_FIELD=DIN4_FIELD

### Notes on the sheet
- (near Q6) ←
- Split series resistors for thermal margin*
- (near Q6) ISOLATION
- *24V input - 1.2V forward LTV356 = 22.8V
  I = V / R,  I = 22.8 / 2000 = 11.4mA
  P = I^2 * R,  P = 0.0114^2 * 2000 = 0.260 W
  1x 1206 can do 0.250 W so split evenly across two for 0.125 W each

### Library data of the parts
D18 = CMP-02577-000018-1: as D2 on sheet AOut_Isolator; Octopart: https://octopart.com/smbj30cahe3%2F52-vishay-43725255; Footprint Url: http://www.vishay.com/docs/95401/smb.pdf; Device Class L2: TVS Diodes; RoHS: TRUE; Automotive: Yes; Height: 2.44mm; Temperature: -55°C to +150°C; Category: Diode; ComponentLink2Description: Datasheet; Reverse Standoff Voltage: 30V; Device Class L3: unset; Package: DO-214AA; ComponentLink2URL: http://www.vishay.com/docs/88392/smbj.pdf; Temperature Range Low: -55°C; Mouser Description: Diode TVS Single Bi-Dir 30V 600W 2-Pin DO-214AA T/R; Temperature Range High: +150°C; Digikey Description: TVS DIODE 30V 48.4V DO214AA; Clamping Voltage: 48.4V; Lead Free: Yes; Device Class L1: Circuit Protection
Q6 = CMP-22018-000003-1: as Q4 on sheet DOut_Relay; RoHS: TRUE; Device Class L3: unset; Package: LTV-356T-D; Temperature Range High: +110°C; Temperature Range Low: -55°C; Device Class L2: Optocouplers; Reverse Voltage: 6V; Temperature: -55°C to +110°C; Manufacturer Part Number: LTV-356T-D; Category: Trans; ComponentLink2URL: https://ve.mouser.com/datasheet/2/239/LTV-356T%20series%20201610-1139805.pdf; Octopart: https://octopart.com/ltv-356t-d-lite-on-11764243; Automotive: No; Digikey Description: OPTOCPL 1 CH TRAN OUT SMT; ComponentLink2Description: Datasheet; Height: 2.4mm; Device Class L1: Optoelectronics; Lead Free: Yes
R36 = CMP-1012-00623-3: as R7 on sheet AOut_Isolator; Number of Pins: 2; Package Reference: 603; Depth: 0.8mm; Mount: SurfaceMount; Package Description: 2-Pin Surface Mount Device, Body 1.6 x 0.85 mm; Datasheet Version: 02/2017; Length: 1.6mm; Lead Free: LeadFree; Height: 0.45mm; Number of Terminations: 2; Max Power Dissipation: 100mW; Min Operating Temperature: -55degC; Datasheet URL: https://industrial.panasonic.com/cdbs/www-data/pdf/RDA0000/AOA0000C304.pdf; Termination: SMD/SMT; Case Code (Metric): 1608; Case Code (Imperial): 0603; Tolerance: 1%; Max Operating Temperature: 155degC; RoHSCompliant: true; Voltage Rating (DC): 75V; Radiation Hardening: No; Packaging: TapeandReel; Composition: ThickFilm; Mounting Technology: SurfaceMount; Manufacturer URL: http://www.panasonic.com/; Width: 0.031inch; REACH SVHC: NoSVHC; Contact Plating: Tin; Military Standard: Not; Package Quantity: 1
R37 R38 = CMP-2003-04406-1: Part Number: ERA8AEB102V; Manufacturer: Panasonic
R39 = CMP-2000-00335-2: Chip Resistor, 220 Ohm, +/- 1%, 0.1 W, -55 to 155 degC, 0603 (1608 Metric), RoHS, Tape and Reel; Voltage Rating: 50 V; Resistance: 22 Ohm; Power Rating: 100 mW; Case\Package: 0603; ComponentLink2Description: Datasheet; PackageDescription: 2-Pin Surface Mount Device, Body 1.6 x 0.85 mm; PackageReference: 0603; ComponentLink1Description: Manufacturer URL; ComponentLink2URL: http://industrial.panasonic.com/cdbs/www-data/pdf/RDA0000/AOA0000C86.pdf; Height: 0.45 mm; Mount: Surface Mount; Case Code (Metric): 1608; Pins: 2; Width: 0.8 mm; Length: 1.6 mm; Package Quantity: 5000; Tolerance: 1%; ComponentLink1URL: http://www.panasonic.com/; Max Operating Temperature: 155 degC; Min Operating Temperature: -55 degC; RoHSCompliant: true; Packaging: Tape and Reel; Case Code (Imperial): 0603; DatasheetVersion: Apr-15; REACH SVHC: No SVHC; Voltage Rating (DC): 50 V

## Sheet SPI_SD.SchDoc
size A4; SheetNumber: 14; SheetTotal: 16
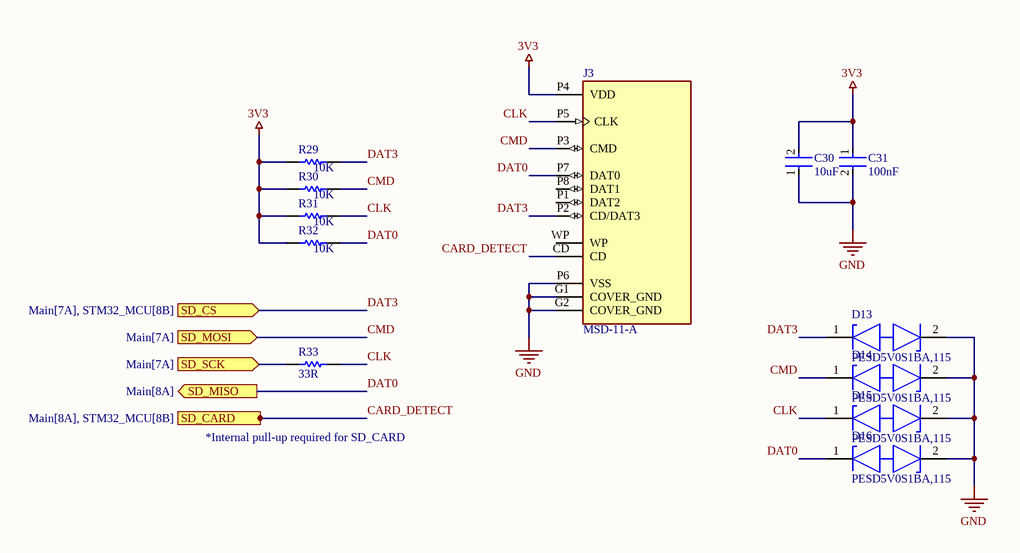
[diagram p15: SPI_SD.SchDoc]

### Parts
C30  10uF  [FP-C1608-080-0_1-MFG]
C31  100nF  [FP-CGA3E-0_3-0_1-IPC_A]
D13  PESD5V0S1BA,115  [FP-SOD323-CA-MFG]
D14  PESD5V0S1BA,115  [FP-SOD323-CA-MFG]
D15  PESD5V0S1BA,115  [FP-SOD323-CA-MFG]
D16  PESD5V0S1BA,115  [FP-SOD323-CA-MFG]
J3  MSD-11-A  [CUI_MSD-11-A]
R29  10K  [RESC1609X55X30LL15T15]
R30  10K  [RESC1609X55X30LL15T15]
R31  10K  [RESC1609X55X30LL15T15]
R32  10K  [RESC1609X55X30LL15T15]
R33  33R  [RESC1608X55X25LL10T15]

### Ports
SD_CARD (out, see Main[8A], STM32_MCU[8B]), SD_CS (in, see Main[7A], STM32_MCU[8B]), SD_MISO (out, see Main[8A]), SD_MOSI (in, see Main[7A]), SD_SCK (in, see Main[7A])

### Nets
3V3: C30.2 C31.1 J3.P4(VDD) R29.1 R30.1 R31.1 R32.1
GND: C30.1 C31.2 D13.2(K2) D14.2(K2) D15.2(K2) D16.2(K2) J3.G1(COVER_GND) J3.G2(COVER_GND) J3.P6(VSS)
CARD_DETECT: J3.CD ; port SD_CARD
CLK: D15.1(K1) J3.P5(CLK) R31.2 R33.2
CMD: D14.1(K1) J3.P3(CMD) R30.2 ; port SD_MOSI
DAT0: D16.1(K1) J3.P7(DAT0) R32.2 ; port SD_MISO
DAT3: D13.1(K1) J3.P2(CD/DAT3) R29.2 ; port SD_CS
PB3: R33.1 ; port SD_SCK

Not connected (* = marked no-connect by the designer): J3 P1(DAT2) P8(DAT1) WP

### Notes on the sheet
- *Internal pull-up required for SD_CARD

### Library data of the parts
C30 = CMP-2000-04979-3: Multilayer Ceramic Capacitors 10μF ±10% 10V X5R SMD 0603; Dielectric Material: Ceramic; Construction: Flat; Height: 0.8mm; Thickness: 0.035inch; Case Code (Metric): 1608; Radiation Hardening: No; Number of Pins: 2; Voltage Rating (DC): 10V; Depth: 0.8mm; Voltage: 10V; RoHS Compliant: Yes; Voltage Rating: 10V; Package Quantity: 1; Resistor Type: Ceramic; Termination: SMD/SMT; Lead Free: Lead Free; REACH SVHC: No SVHC; Tolerance: 10%; Mount: Surface Mount; Series: C; Packaging: Tape and Reel; Width: 0.8mm; Dielectric: X5R; Weight: 7.1E-05oz; Length: 1.6mm; Max Operating Temperature: 85°C; Case Code (Imperial): 0603; Case/Package: 0603; Min Operating Temperature: -55°C; Capacitance: 10uF
C31 = CMP-2000-07546-2: as C9 on sheet STM32_MCU; Weight: 7.1E-05oz; Composition: Ceramic; Max Operating Temperature: 125°C; Termination: SMD/SMT; Dielectric: X7R; Length: 1.6mm; Package Quantity: 1; REACH SVHC: No SVHC; Lead Free: Lead Free; Case Code (Metric): 1608; Min Operating Temperature: -55°C; Packaging: Tape and Reel; Tolerance: 10%; Voltage Rating: 50V; Case Code (Imperial): 0603; Capacitance: 100nF; Case/Package: 0603; Voltage Rating (DC): 50V; Depth: 0.8mm; Radiation Hardening: No; Ratings: AEC-Q200; Mount: Surface Mount; Voltage: 50V; Thickness: 0.035inch; Width: 0.8mm; Height: 0.8mm
D13-D16 = CMP-14432-000001-1: TVS DIODE 5V 14V SOD323
J3 = MSD-11-A: Micro SD Card Connector, 8 Positions, Connector and Ejector, Push In, Auto Eject Out, Surface Mount, 1.85 mm Heaight Above Board, Gold Flash; MF: Same Sky; SnapEDA_Link: https://www.snapeda.com/parts/MSD-11-A/Same+Sky/view-part/?ref=snap; Package: None; Value: *; MP: MSD-11-A; Check_prices: https://www.snapeda.com/parts/MSD-11-A/Same+Sky/view-part/?ref=eda
R29-R32 = CMP-1012-00623-3: as R7 on sheet AOut_Isolator; Number of Pins: 2; Package Reference: 603; Depth: 0.8mm; Mount: SurfaceMount; Package Description: 2-Pin Surface Mount Device, Body 1.6 x 0.85 mm; Datasheet Version: 02/2017; Length: 1.6mm; Lead Free: LeadFree; Height: 0.45mm; Number of Terminations: 2; Max Power Dissipation: 100mW; Min Operating Temperature: -55degC; Datasheet URL: https://industrial.panasonic.com/cdbs/www-data/pdf/RDA0000/AOA0000C304.pdf; Termination: SMD/SMT; Case Code (Metric): 1608; Case Code (Imperial): 0603; Tolerance: 1%; Max Operating Temperature: 155degC; RoHSCompliant: true; Voltage Rating (DC): 75V; Radiation Hardening: No; Packaging: TapeandReel; Composition: ThickFilm; Mounting Technology: SurfaceMount; Manufacturer URL: http://www.panasonic.com/; Width: 0.031inch; REACH SVHC: NoSVHC; Contact Plating: Tin; Military Standard: Not; Package Quantity: 1
R33 = CMP-2000-06939-1: Chip Resistor, 33 Ohm, +/- 1%, 0.1 W, -55 to 155 degC, 0603 (1608 Metric), RoHS, Tape and Reel; Temperature Coefficient: 100PPM/C; Voltage Rating: 75V; Unit Weight: 0.000071oz; Power Rating: 100mW; Brand: Yageo; Resistance: 33Ohms; Product Category: ThickFilmResistors; Packaging: Reel; Tolerance: 1%; RoHS: True; Height: 0.45mm; Case Code - mm: 1608; Series: RC; Datasheet URL: http://www.yageo.com/documents/recent/PYu-RC_Group_51_RoHS_L_7.pdf; Operating Temperature Range: -55Cto+155C; Type: GeneralPurposeChipResistorSurfaceMount; Product: ThickFilmResistorsGeneralPurpose; Package / Case: 0603(1608metric); Width: 0.8mm; Length: 1.6mm; Case Code - in: 0603; Mounting Technology: SurfaceMount; Manufacturer URL: http://www.yageo.com/; Manufacturer: Yageo; Package Reference: 0603; Termination Style: SMD/SMT; Datasheet Version: Rev. 7, 05/2017; Package Description: 2-Pin Surface Mount Device, Body 1.6 x 0.8 mm

## Sheet DOut_Isolator.SchDoc
size A4; SheetNumber: 4; SheetTotal: 16
Used 2 times, as channels U_DOUT1, U_DOUT2. Parts and nets are listed once, with the designators drawn on the sheet.
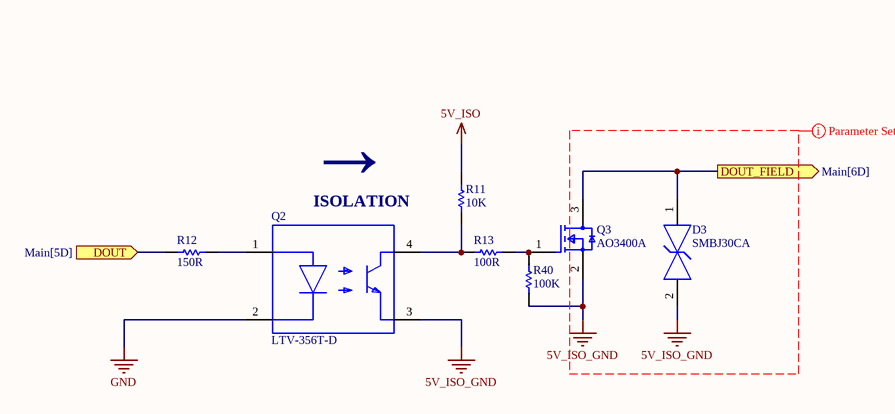
[diagram p16: DOut_Isolator.SchDoc]

### Parts
D3  SMBJ30CA  [FP-SMBJ30CAHE3-52-MFG]
Q2  LTV-356T-D  [FP-LTV-356T-D-MFG]
Q3  AO3400A  [FP-SOT23-MFG]
R11  10K  [RESC1609X55X30LL15T15]
R12  150R  [RESC1608X55X30ML20T20]
R13  100R  [RESC1609X50X30ML8T20]
R40  100K  [RESC1608X55X30ML15T15]

### Ports
DOUT (in, see Main[5D]), DOUT_FIELD (out, see Main[6D])

### Nets
5V_ISO: R11.1
5V_ISO_GND: D3.2 Q2.3(E) Q3.2(S) R40.2
GND: Q2.2(C)
DOUT: R12.1 ; port DOUT
DOUT_FIELD: D3.1 Q3.3(D) ; port DOUT_FIELD
NetQ2_1: Q2.1(A) R12.2
NetQ2_4: Q2.4(C) R11.2 R13.1
NetQ3_1: Q3.1(G) R13.2 R40.1

### Channels
U_DOUT1: designators end in A; ports DOUT=DOUT1 DOUT_FIELD=DOUT1_FIELD
U_DOUT2: designators end in B; ports DOUT=DOUT2 DOUT_FIELD=DOUT2_FIELD

### Layout directives
net class DOUT_SINKING: 5V_ISO_GND

### Notes on the sheet
- (near Q2) ←
- (near Q2) ISOLATION

### Library data of the parts
D3 = CMP-02577-000018-1: as D2 on sheet AOut_Isolator; Octopart: https://octopart.com/smbj30cahe3%2F52-vishay-43725255; Footprint Url: http://www.vishay.com/docs/95401/smb.pdf; Device Class L2: TVS Diodes; RoHS: TRUE; Automotive: Yes; Height: 2.44mm; Temperature: -55°C to +150°C; Category: Diode; ComponentLink2Description: Datasheet; Reverse Standoff Voltage: 30V; Device Class L3: unset; Package: DO-214AA; ComponentLink2URL: http://www.vishay.com/docs/88392/smbj.pdf; Temperature Range Low: -55°C; Mouser Description: Diode TVS Single Bi-Dir 30V 600W 2-Pin DO-214AA T/R; Temperature Range High: +150°C; Digikey Description: TVS DIODE 30V 48.4V DO214AA; Clamping Voltage: 48.4V; Lead Free: Yes; Device Class L1: Circuit Protection
Q2 = CMP-22018-000003-1: as Q4 on sheet DOut_Relay; RoHS: TRUE; Device Class L3: unset; Package: LTV-356T-D; Temperature Range High: +110°C; Temperature Range Low: -55°C; Device Class L2: Optocouplers; Reverse Voltage: 6V; Temperature: -55°C to +110°C; Manufacturer Part Number: LTV-356T-D; Category: Trans; ComponentLink2URL: https://ve.mouser.com/datasheet/2/239/LTV-356T%20series%20201610-1139805.pdf; Octopart: https://octopart.com/ltv-356t-d-lite-on-11764243; Automotive: No; Digikey Description: OPTOCPL 1 CH TRAN OUT SMT; ComponentLink2Description: Datasheet; Height: 2.4mm; Device Class L1: Optoelectronics; Lead Free: Yes
Q3 = CMP-83955-000006-1: MOSFET N-CH 30V 5.7A SOT23; Input Capacitance: 630pF; Number of Elements: 1; Rds On Max: 26.5mR; Max Power Dissipation: 1.4W; Gate to Source Voltage (Vgs): 12V; Min Operating Temperature: -55°C; Lead Free: Lead Free; Number of Pins: 3; Drain to Source Voltage (Vdss): 30V; Case/Package: SOT-23; Mount: Surface Mount; Continuous Drain Current (ID): 5.7A; Radiation Hardening: No; Packaging: Tape and Reel; Max Operating Temperature: 150°C; Power Dissipation: 1.4W
R11 = CMP-1012-00623-3: as R7 on sheet AOut_Isolator; Number of Pins: 2; Package Reference: 603; Depth: 0.8mm; Mount: SurfaceMount; Package Description: 2-Pin Surface Mount Device, Body 1.6 x 0.85 mm; Datasheet Version: 02/2017; Length: 1.6mm; Lead Free: LeadFree; Height: 0.45mm; Number of Terminations: 2; Max Power Dissipation: 100mW; Min Operating Temperature: -55degC; Datasheet URL: https://industrial.panasonic.com/cdbs/www-data/pdf/RDA0000/AOA0000C304.pdf; Termination: SMD/SMT; Case Code (Metric): 1608; Case Code (Imperial): 0603; Tolerance: 1%; Max Operating Temperature: 155degC; RoHSCompliant: true; Voltage Rating (DC): 75V; Radiation Hardening: No; Packaging: TapeandReel; Composition: ThickFilm; Mounting Technology: SurfaceMount; Manufacturer URL: http://www.panasonic.com/; Width: 0.031inch; REACH SVHC: NoSVHC; Contact Plating: Tin; Military Standard: Not; Package Quantity: 1
R12 = CMP-2000-00914-1: as R35 on sheet DOut_Relay
R13 = CMP-2000-03824-5: Chip Resistor, 100 Ohm, +/- 1%, 100 mW,-55 to 155 degC, 0603 (1608 Metric), RoHS, Tape and Ree; Manufacturer: Vishay Semiconductor; ComponentLink2URL: http://www.vishay.com/docs/20035/dcrcwe3.pdf; ComponentLink1URL: http://www.vishay.com/; Mounting Technology: Surface Mount; ComponentLink1Description: Manufacturer URL; ComponentLink2Description: Datasheet; PackageDescription: 2-Pin Surface Mount Device, Body 1.575 x 0.85 mm; PackageReference: 0603; DatasheetVersion: 06/2012
R40 = CMP-2000-00182-1: Part Number: ERJ-3EKF1003V; Manufacturer: Panasonic

## Nets that join several sheets
3V3: Power_Supply (C23.2 C24.2 U12.2 U12.4), I2C_Display (J2.2 SW_DISP1.1 SW_DISP1.2), I2C_EEPROM_AT24C32 (5 pins), I2C_RTC_DS3231 (C3.2 U6.2 U6.4), RS485 (U13.1 U14.1), I2C_Isolator (C2.1 R3.2 R4.2 U1.1), U_AIN1 (U7A.8), U_AIN2 (U7B.8), U_AIN3 (U7C.8), U_AIN4 (U7D.8), U_AOUT1 (U2A.1 U3A.5), U_AOUT2 (U2B.1 U3B.5), BTN2_FactoryReset (SW_FR1.1 SW_FR1.2), STM32_MCU (11 pins), I2C_PowerMonitor_INA226 (C28.2 U17.6), U_DIN1 (R36A.1), U_DIN2 (R36B.1), U_DIN3 (R36C.1), U_DIN4 (R36D.1), SPI_SD (7 pins)
5V_ISO: Power_Supply (8 pins), RS485 (8 pins), I2C_Isolator (C1.1 R1.2 R2.2 U1.8), U_AIN1 (U7A.1 U8A.5), U_AIN2 (U7B.1 U8B.5), U_AIN3 (U7C.1 U8C.5), U_AIN4 (U7D.1 U8D.5), U_AOUT1 (U2A.8 U4A.5 U5A.5), U_AOUT2 (U2B.8 U4B.5 U5B.5), U_RELAY1 (D17A.1 K1A.A1 R34A.1 R52A.2), U_RELAY2 (D17B.1 K1B.A1 R34B.1 R52B.2), U_DOUT1 (R11A.1), U_DOUT2 (R11B.1)
5V_ISO_GND: Main (5 pins), Power_Supply (8 pins), RS485 (12 pins), I2C_Isolator (5 pins), U_AIN1 (7 pins), U_AIN2 (7 pins), U_AIN3 (7 pins), U_AIN4 (7 pins), U_AOUT1 (8 pins), U_AOUT2 (8 pins), U_RELAY1 (Q5A.2), U_RELAY2 (Q5B.2), U_DIN1 (D18A.2 Q6A.2), U_DIN2 (D18B.2 Q6B.2), U_DIN3 (D18C.2 Q6C.2), U_DIN4 (D18D.2 Q6D.2), U_DOUT1 (D3A.2 Q2A.3 Q3A.2 R40A.2), U_DOUT2 (D3B.2 Q2B.3 Q3B.2 R40B.2)
24V: Power_Supply (C19.2 C21.2 U11.1), I2C_PowerMonitor_INA226 (R26.1 U17.8 U17.9)
24V_PREMEASURE: Power_Supply (6 pins), I2C_PowerMonitor_INA226 (R26.2 U17.10)
GND: Main (J-SUPPLY1.1), Power_Supply (15 pins), I2C_Display (J2.1 SW_DISP1.5), I2C_EEPROM_AT24C32 (C29.1 U18.4 U18.7), I2C_RTC_DS3231 (BT1.1 C3.1 U6.13), RS485 (U13.4 U14.4), I2C_Isolator (C2.2 U1.4), U_AIN1 (U7A.5 U7A.6), U_AIN2 (U7B.5 U7B.6), U_AIN3 (U7C.5 U7C.6), U_AIN4 (U7D.5 U7D.6), U_AOUT1 (R6A.2 U2A.3 U2A.4 U3A.2), U_AOUT2 (R6B.2 U2B.3 U2B.4 U3B.2), STM32_MCU (31 pins), I2C_PowerMonitor_INA226 (C28.1 U17.1 U17.2 U17.7), U_RELAY1 (Q4A.2), U_RELAY2 (Q4B.2), U_DIN1 (Q6A.3), U_DIN2 (Q6B.3), U_DIN3 (Q6C.3), U_DIN4 (Q6D.3), SPI_SD (9 pins), U_DOUT1 (Q2A.2), U_DOUT2 (Q2B.2)
A: Main (J_RS1.2), RS485 (R23.2 R25.1 U15.1 U16.6)
AIN1: U_AIN1 (U7A.7), STM32_MCU (U9.8)
AIN1_FIELD: Main (J_AIN1.5), U_AIN1 (D4A.2 SW2A.2)
AIN2: U_AIN2 (U7B.7), STM32_MCU (U9.9)
AIN2_FIELD: Main (J_AIN1.4), U_AIN2 (D4B.2 SW2B.2)
AIN3: U_AIN3 (U7C.7), STM32_MCU (U9.25)
AIN3_FIELD: Main (J_AIN1.3), U_AIN3 (D4C.2 SW2C.2)
AIN4: U_AIN4 (U7D.7), STM32_MCU (U9.24)
AIN4_FIELD: Main (J_AIN1.2), U_AIN4 (D4D.2 SW2D.2)
AOUT1: U_AOUT1 (U3A.3), STM32_MCU (U9.12)
AOUT1_FIELD: Main (J_AOUT1.3), U_AOUT1 (SW1A.2)
AOUT2: U_AOUT2 (U3B.3), STM32_MCU (U9.13)
AOUT2_FIELD: Main (J_AOUT1.2), U_AOUT2 (SW1B.2)
B: Main (J_RS1.3), RS485 (J1.6 R24.2 U15.2 U16.7)
BTN1: I2C_Display (R27.2), STM32_MCU (U9.2)
BTN2: BTN2_FactoryReset (R28.2), STM32_MCU (U9.47)
CARD_DETECT: STM32_MCU (U9.39), SPI_SD (J3.CD)
CMD: STM32_MCU (U9.15), SPI_SD (D14.1 J3.P3 R30.2)
DAT0: STM32_MCU (U9.14), SPI_SD (D16.1 J3.P7 R32.2)
DAT3: STM32_MCU (U9.40), SPI_SD (D13.1 J3.P2 R29.2)
DIN1: STM32_MCU (U9.10), U_DIN1 (R36A.2 R39A.2)
DIN1_FIELD: Main (J_DIN1.5), U_DIN1 (D18A.1 R37A.1)
DIN2: STM32_MCU (U9.11), U_DIN2 (R36B.2 R39B.2)
DIN2_FIELD: Main (J_DIN1.4), U_DIN2 (D18B.1 R37B.1)
DIN3: STM32_MCU (U9.26), U_DIN3 (R36C.2 R39C.2)
DIN3_FIELD: Main (J_DIN1.3), U_DIN3 (D18C.1 R37C.1)
DIN4: STM32_MCU (U9.27), U_DIN4 (R36D.2 R39D.2)
DIN4_FIELD: Main (J_DIN1.2), U_DIN4 (D18D.1 R37D.1)
DOUT1: STM32_MCU (U9.16), U_DOUT1 (R12A.1)
DOUT1_FIELD: Main (J_DOUT1.3), U_DOUT1 (D3A.1 Q3A.3)
DOUT2: STM32_MCU (U9.17), U_DOUT2 (R12B.1)
DOUT2_FIELD: Main (J_DOUT1.2), U_DOUT2 (D3B.1 Q3B.3)
I2C_SCL: I2C_Display (J2.3), I2C_EEPROM_AT24C32 (U18.6), I2C_RTC_DS3231 (U6.16), I2C_Isolator (R4.1 U1.3), STM32_MCU (U9.38), I2C_PowerMonitor_INA226 (U17.5)
I2C_SDA: I2C_Display (J2.4), I2C_EEPROM_AT24C32 (U18.5), I2C_RTC_DS3231 (U6.15), I2C_Isolator (R3.1 U1.2), STM32_MCU (U9.45), I2C_PowerMonitor_INA226 (U17.4)
NetF1_1: Main (J-SUPPLY1.2), Power_Supply (F1.1)
NetJ_RELAY1_1: Main (J_RELAY1.1), U_RELAY1 (K1A.COM)
NetJ_RELAY1_2: Main (J_RELAY1.2), U_RELAY1 (K1A.NC)
NetJ_RELAY1_3: Main (J_RELAY1.3), U_RELAY1 (K1A.NO)
NetJ_RELAY2_1: Main (J_RELAY2.1), U_RELAY2 (K1B.COM)
NetJ_RELAY2_2: Main (J_RELAY2.2), U_RELAY2 (K1B.NC)
NetJ_RELAY2_3: Main (J_RELAY2.3), U_RELAY2 (K1B.NO)
PA8: RS485 (U13.3), STM32_MCU (U9.30)
PA9: RS485 (U14.3), STM32_MCU (U9.31)
PA10: RS485 (U14.2), STM32_MCU (U9.32)
PB1: STM32_MCU (U9.18), U_RELAY1 (R35A.1)
PB2: STM32_MCU (U9.19), U_RELAY2 (R35B.1)
PB3: STM32_MCU (U9.41), SPI_SD (R33.1)